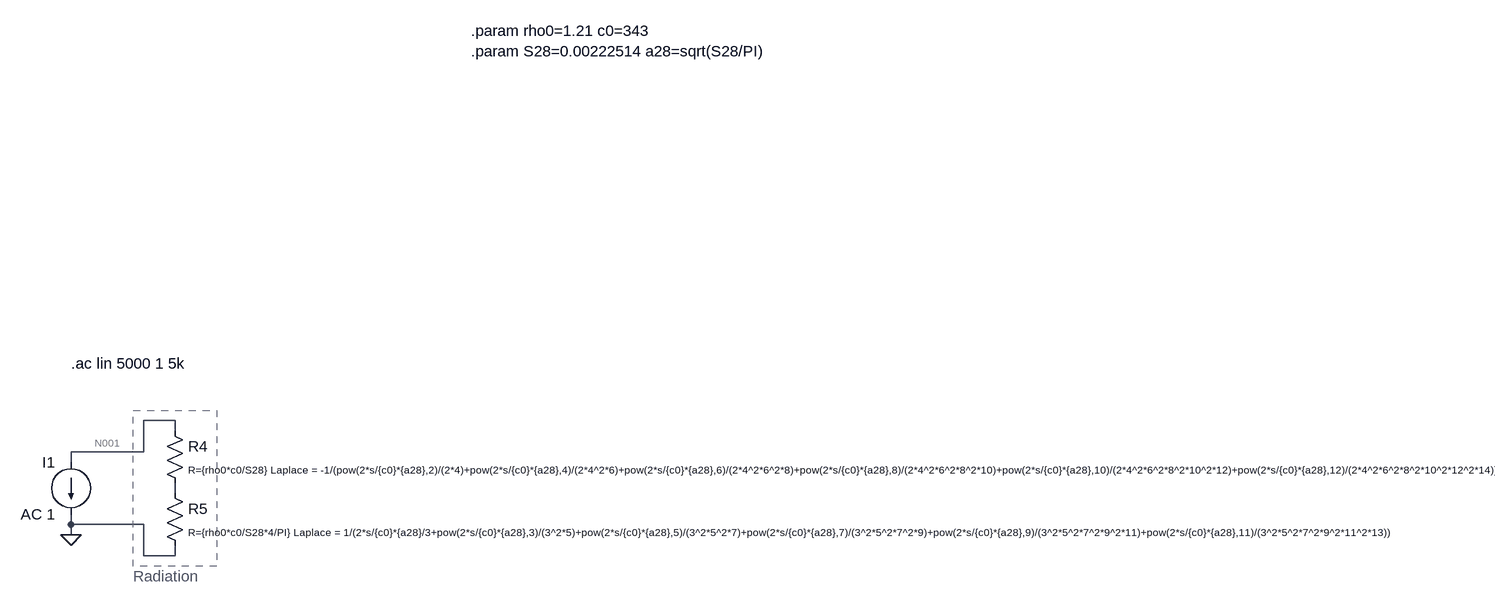
[diagram p0: schematic AC_Radiation.asc]
AC_Radiation.asc, the LTspice schematic file:
Version 4
SHEET 1 10704 2064
WIRE -416 352 -464 352
WIRE -416 368 -416 352
WIRE -464 400 -464 352
WIRE -464 400 -576 400
WIRE -576 416 -576 400
WIRE -416 464 -416 448
WIRE -576 512 -576 496
WIRE -464 512 -576 512
WIRE -576 528 -576 512
WIRE -464 560 -464 512
WIRE -416 560 -416 544
WIRE -416 560 -464 560
FLAG -576 528 0
SYMBOL res -432 352 R0
WINDOW 3 36 76 Left 1
SYMATTR Value R={rho0*c0/S28} Laplace = -1/(pow(2*s/{c0}*{a28},2)/(2*4)+pow(2*s/{c0}*{a28},4)/(2*4^2*6)+pow(2*s/{c0}*{a28},6)/(2*4^2*6^2*8)+pow(2*s/{c0}*{a28},8)/(2*4^2*6^2*8^2*10)+pow(2*s/{c0}*{a28},10)/(2*4^2*6^2*8^2*10^2*12)+pow(2*s/{c0}*{a28},12)/(2*4^2*6^2*8^2*10^2*12^2*14))
SYMATTR InstName R4
SYMBOL res -432 448 R0
WINDOW 3 36 76 Left 1
SYMATTR Value R={rho0*c0/S28*4/PI} Laplace = 1/(2*s/{c0}*{a28}/3+pow(2*s/{c0}*{a28},3)/(3^2*5)+pow(2*s/{c0}*{a28},5)/(3^2*5^2*7)+pow(2*s/{c0}*{a28},7)/(3^2*5^2*7^2*9)+pow(2*s/{c0}*{a28},9)/(3^2*5^2*7^2*9^2*11)+pow(2*s/{c0}*{a28},11)/(3^2*5^2*7^2*9^2*11^2*13))
SYMATTR InstName R5
SYMBOL current -576 416 M0
SYMATTR InstName I1
SYMATTR Value AC 1
TEXT 40 -248 Left 2 !.param rho0=1.21 c0=343\n.param S28=0.00222514 a28=sqrt(S28/PI)
TEXT -576 264 Left 2 !.ac lin 5000 1 5k
TEXT -480 592 Left 2 ;Radiation
RECTANGLE Normal -352 576 -480 336 3

The netlist it stands for:
* AC_Radiation.asc
R4 N001 N002 R={rho0*c0/S28} Laplace = -1/(pow(2*s/{c0}*{a28},2)/(2*4)+pow(2*s/{c0}*{a28},4)/(2*4^2*6)+pow(2*s/{c0}*{a28},6)/(2*4^2*6^2*8)+pow(2*s/{c0}*{a28},8)/(2*4^2*6^2*8^2*10)+pow(2*s/{c0}*{a28},10)/(2*4^2*6^2*8^2*10^2*12)+pow(2*s/{c0}*{a28},12)/(2*4^2*6^2*8^2*10^2*12^2*14))
R5 N002 0 R={rho0*c0/S28*4/PI} Laplace = 1/(2*s/{c0}*{a28}/3+pow(2*s/{c0}*{a28},3)/(3^2*5)+pow(2*s/{c0}*{a28},5)/(3^2*5^2*7)+pow(2*s/{c0}*{a28},7)/(3^2*5^2*7^2*9)+pow(2*s/{c0}*{a28},9)/(3^2*5^2*7^2*9^2*11)+pow(2*s/{c0}*{a28},11)/(3^2*5^2*7^2*9^2*11^2*13))
I1 N001 0 AC 1
.param rho0=1.21 c0=343
.param S28=0.00222514 a28=sqrt(S28/PI)
.ac lin 5000 1 5k
* Radiation
.backanno
.end

* Results of the author's LTspice run, read from the files saved beside the schematic
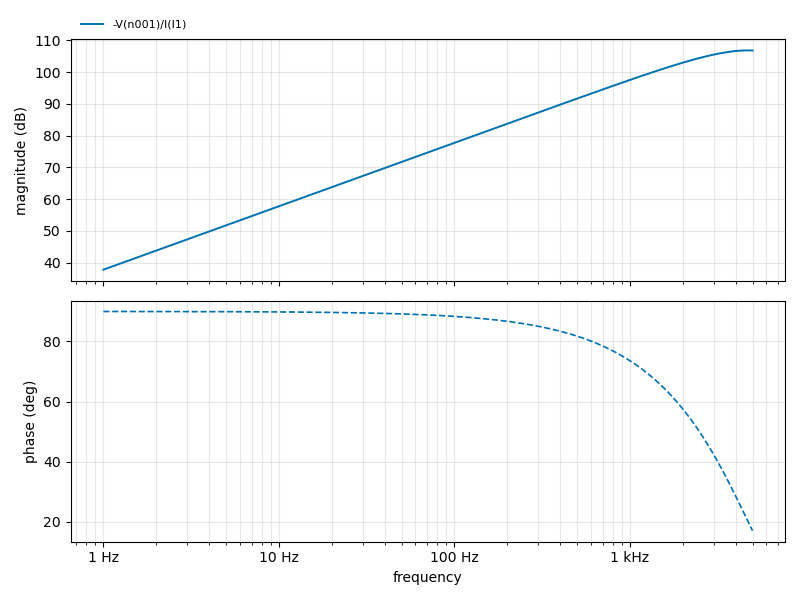
[diagram p1: AC Analysis of AC_Radiation.asc, plotted from the saved traces]
* AC Analysis, 1 run:
*   -V(n001)/I(I1): 37.75 dB at 1 Hz, 106.84 dB at 5 kHz, peak 106.87 dB at 4.699 kHz, 3 dB below the peak at 2.266 kHz